# Altium project smart-water-quality-breakout.PrjPcb (part 5 of 5)

## Sheet rtc.SchDoc
size Letter
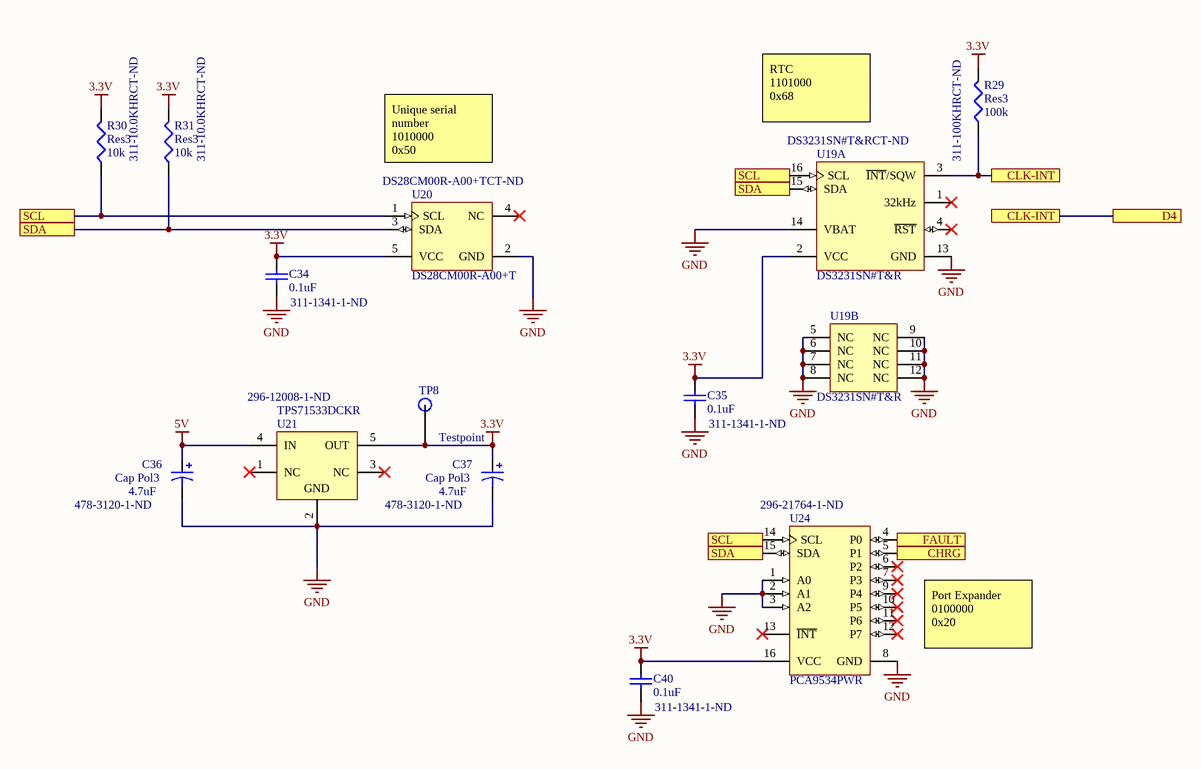
[diagram p5: rtc.SchDoc]

### Parts
C34  value 0.1uF  Supplier Part Number 1: 311-1341-1-ND  [1608[0603]]  (hidden comment: Cap Semi)
C35  value 0.1uF  Supplier Part Number 1: 311-1341-1-ND  [1608[0603]]  (hidden comment: Cap Semi)
C36  Cap Pol3  value 4.7uF  Supplier Part Number 1: 478-3120-1-ND  [1206-pol]
C37  Cap Pol3  value 4.7uF  Supplier Part Number 1: 478-3120-1-ND  [1206-pol]
C40  value 0.1uF  Supplier Part Number 1: 311-1341-1-ND  [1608[0603]]  (hidden comment: Cap Semi)
R29  Res3  value 100k  Supplier Part Number 1: 311-100KHRCT-ND  [J1-0603]
R30  Res3  value 10k  Supplier Part Number 1: 311-10.0KHRCT-ND  [J1-0603]
R31  Res3  value 10k  Supplier Part Number 1: 311-10.0KHRCT-ND  [J1-0603]
TP8  Testpoint  [testpoint]  (no BOM)
U19  DS3231SN#T&R  Supplier Part Number 1: DS3231SN#T&RCT-ND  [W16#H2_M]  (parts A,B of 2)
U20  DS28CM00R-A00+T  Supplier Part Number 1: DS28CM00R-A00+TCT-ND  [U5+1_M]
U21  TPS71533DCKR  Supplier Part Number 1: 296-12008-1-ND  [DCK0005A_L]
U24  PCA9534PWR  Supplier Part Number 1: 296-21764-1-ND  [PW0016A_N]

### Ports
CHRG, CLK-INT, D4, FAULT, SCL, SDA

### Nets
3.3V: C34.1 C35.1 C37.1 C40.1 R29.2 R30.2 R31.2 TP8.1 U19.2(VCC) U20.5(VCC) U21.5(OUT) U24.16(VCC)
5V: C36.1 U21.4(IN)
GND: C34.2 C35.2 C36.2 C37.2 C40.2 U19.5(NC) U19.6(NC) U19.7(NC) U19.8(NC) U19.9(NC) U19.10(NC) U19.11(NC) U19.12(NC) U19.13(GND) U19.14(VBAT) U20.2(GND) U21.2(GND) U24.1(A0) U24.2(A1) U24.3(A2) U24.8(GND)
NetR29_1: R29.1 U19.3(~{INT}/SQW) ; port CLK-INT, port D4
NetR30_1: R30.1 U19.16(SCL) U20.1(SCL) U24.14(SCL) ; port SCL
NetR31_1: R31.1 U19.15(SDA) U20.3(SDA) U24.15(SDA) ; port SDA
NetR32_2: U24.5(P1) ; port CHRG
NetR33_2: U24.4(P0) ; port FAULT

Not connected (* = marked no-connect by the designer): U19 1(32kHz)* 4(~{RST})*; U20 4(NC)*; U21 1(NC)* 3(NC)*; U24 6(P2)* 7(P3)* 9(P4)* 10(P5)* 11(P6)* 12(P7)* 13(~{INT})*

### Notes on the sheet
- Unique serial number
  1010000
  0x50
- RTC
  1101000
  0x68
- Port Expander
  0100000
  0x20

### Library data of the parts
C34 C35 C40 = Cap Semi: Capacitor (Semiconductor SIM Model); Manufacturer: Yageo; Manufacturer Part Number: CC0603KRX7R8BB104; Capacitance: 100nF; Tolerance: 10%; Voltage Rating: 25V; Dielectric: X7R; ComponentLink1URL: http://www.samsungsem.com/servlet/FileDownload?type=spec&file=CL10B104KB8NNNC.pdf; ComponentLink1Description: http://www.samsungsem.com/servlet/FileDownload?type=spec&file=CL10B104KB8NNNC.pdf; Supplier 1: Digi-Key; Stock 1: 22812167; Pricing 1: 1=0.10000, 10=0.05000, 100=0.02220, 500=0.01584, 1000=0.01245 (USD); RoHS: Yes; Mount: Surface Mount; Case/Package: 0603; Number of Pins: 2; Case Code (Imperial): 0603; Case Code (Metric): 1608; Min Operating Temperature: -55°C; Max Operating Temperature: 125°C; Packaging: Tape and Reel; Package Quantity: 1; Voltage Rating (DC): 25V; Termination: SMD/SMT; Composition: Ceramic; Voltage: 25V; Length: 1.6mm; Height: 0.8mm; Width: 0.8mm; Thickness: 0.035inch; Depth: 0.8mm; Radiation Hardening: No; REACH SVHC: Unknown; Lead Free: Lead Free; Halogen Free: Halogen Free; ComponentLink2URL: https://datasheet.ciiva.com/11786/0900766b80c10176-11786120.pdf?src-supplier=RSComponents; ComponentLink2Description: https://datasheet.ciiva.com/11786/0900766b80c10176-11786120.pdf?src-supplier=RSComponents; ComponentLink3URL: https://datasheet.ciiva.com/144/mlccorderingcode-144075.pdf?src-supplier=Digi-Key; ComponentLink3Description: https://datasheet.ciiva.com/144/mlccorderingcode-144075.pdf?src-supplier=Digi-Key; ComponentLink4URL: https://datasheet.ciiva.com/17434/upy-gphc-x7r-6-3v-to-50v-8-17434263.pdf?src-supplier=Avnet+Europe; ComponentLink4Description: https://datasheet.ciiva.com/17434/upy-gphc-x7r-6-3v-to-50v-8-17434263.pdf?src-supplier=Avnet+Europe; ComponentLink5URL: https://datasheet.ciiva.com/26829/getdatasheetpartid-403577-26829431.pdf?src-supplier=Verical; ComponentLink5Description: https://datasheet.ciiva.com/26829/getdatasheetpartid-403577-26829431.pdf?src-supplier=Verical; ComponentLink6URL: https://datasheet.ciiva.com/11587/upy-gphc-x7r-6-3v-to-50v-8-11587208.pdf?src-supplier=Avnet; ComponentLink6Description: https://datasheet.ciiva.com/11587/upy-gphc-x7r-6-3v-to-50v-8-11587208.pdf?src-supplier=Avnet; ComponentLink7URL: https://datasheet.ciiva.com/13389/upy-gphc-x7r-6-3v-to-50v-8-13389352.pdf?src-supplier=Mouser; ComponentLink7Description: https://datasheet.ciiva.com/13389/upy-gphc-x7r-6-3v-to-50v-8-13389352.pdf?src-supplier=Mouser; ComponentLink8URL: https://datasheet.ciiva.com/28450/1489800-28450584.pdf?src-supplier=Element14; ComponentLink8Description: https://datasheet.ciiva.com/28450/1489800-28450584.pdf?src-supplier=Element14; ComponentLink9URL: https://datasheet.ciiva.com/144/mlccorderingcode-144073.pdf?src-supplier=Digi-Key; ComponentLink9Description: https://datasheet.ciiva.com/144/mlccorderingcode-144073.pdf?src-supplier=Digi-Key; ComponentLink10URL: https://datasheet.ciiva.com/144/mlccorderingcode-144074.pdf?src-supplier=Digi-Key; ComponentLink10Description: https://datasheet.ciiva.com/144/mlccorderingcode-144074.pdf?src-supplier=Digi-Key; ComponentLink11URL: https://datasheet.ciiva.com/7978/1489800-7978155.pdf?src-supplier=Element14; ComponentLink11Description: https://datasheet.ciiva.com/7978/1489800-7978155.pdf?src-supplier=Element14
C36 C37 = Cap Pol3: Polarized Capacitor (Surface Mount); Manufacturer: AVX Corporation; Manufacturer Part Number: NOJA475M010RWJ; Manufacturer Size Code: A; Tolerance: ±20%; Dissipation Factor: 6%; Supplier 1: Digi-Key; RoHS: RoHS Compliant; Category: Capacitors; Stock 1: 5356; Pricing 1: 1=0.68, 10=0.485, 100=0.319, 500=0.2363, 1000=0.20086 (CAD); Packaging: Cut Tape (CT); Part Status: Active; Mounting Type: Surface Mount; Package / Case: 1206 (3216 Metric); Height - Seated (Max): 0.071" (1.80mm); Features: -; Operating Temperature: -55°C ~ 105°C; Supplier Device Package: 1206 (3216 Metric); Size / Dimension: 0.126" L x 0.063" W (3.20mm x 1.60mm); ComponentLink1URL: http://datasheets.avx.com/NOJ.pdf; ComponentLink1Description: http://datasheets.avx.com/NOJ.pdf
R29 = Res3: Resistor; Manufacturer: Yageo; Manufacturer Part Number: RC0603FR-07100KL; Tolerance: ±1%; Power (Watts): 0.1W, 1/10W; Temperature Coefficient: ±100ppm/°C; Published: 8-Jun-2000; LatestRevisionDate: 29-May-2009; LatestRevisionNote: IPC-7351 Footprint Added.; PackageReference: J1-0603; Publisher: Altium Limited; PackageDescription: Chip Resistor; Supplier 1: Digi-Key; RoHS: RoHS Compliant; Category: Resistors; Stock 1: 8279421; Pricing 1: 1=0.14, 10=0.021, 100=0.0086, 1000=0.00383, 2500=0.00333 (CAD); Packaging: Cut Tape (CT); Part Status: Active; Composition: Thick Film; Features: Moisture Resistant; Operating Temperature: -55°C ~ 155°C; Package / Case: 0603 (1608 Metric); Supplier Device Package: 0603; Size / Dimension: 0.063" L x 0.032" W (1.60mm x 0.80mm); Height - Seated (Max): 0.022" (0.55mm); Failure Rate: -; ComponentLink1URL: http://www.yageo.com/documents/recent/PYu-RC_Group_51_RoHS_L_7.pdf; ComponentLink1Description: http://www.yageo.com/documents/recent/PYu-RC_Group_51_RoHS_L_7.pdf
R30 R31 = Res3: Resistor; Manufacturer: Yageo; Manufacturer Part Number: RC0603FR-0710KL; Tolerance: 1%; Resistance: 10kR; Temperature Coefficient: 100ppm/°C; Voltage Rating (DC): 50V; Power Rating: 100mW; Voltage Rating: 75V; Published: 8-Jun-2000; LatestRevisionDate: 29-May-2009; LatestRevisionNote: IPC-7351 Footprint Added.; PackageReference: J1-0603; Publisher: Altium Limited; PackageDescription: Chip Resistor; Supplier 1: Digi-Key; Stock 1: 90146690; Pricing 1: 1 = 0.10000, 10 = 0.02400, 100 = 0.00970, 1000 = 0.00437, 2500 = 0.00379 (USD); RoHS: Yes; Case/Package: 0603; Number of Pins: 2; Weight: 7.1E-05oz; Case Code (Imperial): 0603; Case Code (Metric): 1608; Min Operating Temperature: -55°C; Max Operating Temperature: 155°C; Composition: Thick Film; Packaging: Tape and Reel; Military Standard: Not; Termination: SMD/SMT; Length: 1.6mm; Height: 0.45mm; Width: 0.8mm; Depth: 0.8mm; Lead Pitch: 0.3mm; REACH SVHC: No SVHC; Lead Free: Lead Free; ComponentLink1URL: https://datasheet.ciiva.com/7660/38590-7660789.pdf?src-supplier=Element14; ComponentLink1Description: https://datasheet.ciiva.com/7660/38590-7660789.pdf?src-supplier=Element14; ComponentLink2URL: https://datasheet.ciiva.com/15189/getdatasheetpartid-409289-15189591.pdf?src-supplier=Verical; ComponentLink2Description: https://datasheet.ciiva.com/15189/getdatasheetpartid-409289-15189591.pdf?src-supplier=Verical; ComponentLink3URL: https://datasheet.ciiva.com/46440/1868787-46440891.pdf?src-supplier=Element14; ComponentLink3Description: https://datasheet.ciiva.com/46440/1868787-46440891.pdf?src-supplier=Element14; ComponentLink4URL: https://datasheet.ciiva.com/7983/443971-7983596.pdf?src-supplier=Element14; ComponentLink4Description: https://datasheet.ciiva.com/7983/443971-7983596.pdf?src-supplier=Element14; ComponentLink5URL: https://datasheet.ciiva.com/7746/1738695-7746239.pdf?src-supplier=Element14; ComponentLink5Description: https://datasheet.ciiva.com/7746/1738695-7746239.pdf?src-supplier=Element14; ComponentLink6URL: https://datasheet.ciiva.com/22747/443971-22747519.pdf?src-supplier=Element14; ComponentLink6Description: https://datasheet.ciiva.com/22747/443971-22747519.pdf?src-supplier=Element14
TP8 = SMT Testpoint
U19 = CMP-0254-00375-1: Extremely Accurate I2C-Integrated Real-Time Clock/TCXO/Crystal, 16-Pin SO, -40 to 85 degC, RoHS Qualified, Reel; Manufacturer: Maxim; Max Supply Voltage: 5.5V; Min Supply Voltage: 2.3V; Interface: I2C; Logic Function: Clock; Time Format: HH:MM:SS; Date Format: YY-MM-DD-dd; Operating Supply Voltage: 3.3V; DatasheetVersion: Rev 8, Jul-2010; ComponentLink2Description: Datasheet; ComponentLink3Description: Package Specification; Code_JEDEC: MS-013-AA; ComponentLink1URL: http://www.maxim-ic.com; PackageDescription: 16-Pin Small-Outline IC, Wide (0.3in), 1.27 mm Pitch, SOIC (W), RoHS Qualified; ComponentLink3URL: http://pdfserv.maxim-ic.com/package_dwgs/21-0042.PDF; Code_IPC: SOIC127P1030-16; PackageReference: W16#H2; PackageVersion: revD, 2010; ComponentLink1Description: Manufacturer URL; ComponentLink2URL: http://datasheets.maxim-ic.com/en/ds/DS3231.pdf; Supplier 1: Digi-Key; Manufacturer Part Number: DS3231SN#T&R; Stock 1: 3292; Pricing 1: 1=9.05000, 10=8.17200, 25=7.79160, 100=6.76520, 250=6.46120, 500=5.89108 (USD); RoHS: Yes; Mount: Surface Mount; Case/Package: SOIC; Number of Pins: 16; Contact Plating: Tin; Min Operating Temperature: -40°C; Max Operating Temperature: 85°C; Packaging: Tape and Reel; Package Quantity: 1000; Radiation Hardening: No; Lead Free: Lead Free; ComponentLink4URL: https://datasheet.ciiva.com/17307/ds3231-17307128.pdf?src-supplier=Avnet+Europe; ComponentLink4Description: https://datasheet.ciiva.com/17307/ds3231-17307128.pdf?src-supplier=Avnet+Europe; ComponentLink5URL: https://datasheet.ciiva.com/12291/ds3231-102175-12291260.pdf?src-supplier=Mouser; ComponentLink5Description: https://datasheet.ciiva.com/12291/ds3231-102175-12291260.pdf?src-supplier=Mouser; ComponentLink6URL: https://datasheet.ciiva.com/14244/ds3231-14244637.pdf?src-supplier=Avnet; ComponentLink6Description: https://datasheet.ciiva.com/14244/ds3231-14244637.pdf?src-supplier=Avnet; ComponentLink7URL: https://datasheet.ciiva.com/14244/ds3231-14244733.pdf?src-supplier=Avnet; ComponentLink7Description: https://datasheet.ciiva.com/14244/ds3231-14244733.pdf?src-supplier=Avnet
U20 = CMP-0219-00326-1: I²C/SMBus Silicon Serial Number, 5-pin SOT23, -40° to + 85° C, Pb-Free, Tape and Reel; Manufacturer: Maxim; Max Supply Voltage: 5.25V; Min Supply Voltage: 1.62V; DatasheetVersion: Nov-2006; PackageReference: U5+1; Code_JEDEC: MO-178AA; PackageVersion: revF, 2006; PackageDescription: 5-Pin Small-Outline Transistor Package, 0.95 mm Pitch, 2.8 mm Lead Span, SOT-23, Pb-Free; Supplier 1: Digi-Key; Manufacturer Part Number: DS28CM00R-A00+T; RoHS: Yes; Stock 1: 17327; Pricing 1: 1 = 1.67000, 10 = 1.50400, 25 = 1.41880, 100 = 1.20880, 250 = 1.13508, 500 = 0.99318, 1000 = 0.82292 (USD); Mount: Surface Mount; Case/Package: SOT-23-5; Number of Pins: 5; Min Operating Temperature: -40°C; Max Operating Temperature: 85°C; Packaging: Tape and Reel; Package Quantity: 1; Length: 3mm; Height: 1.3mm; Width: 1.75mm; Radiation Hardening: No; REACH SVHC: Unknown; Lead Free: Lead Free; ComponentLink1URL: https://datasheets.maximintegrated.com/en/ds/DS28CM00.pdf; ComponentLink1Description: https://datasheets.maximintegrated.com/en/ds/DS28CM00.pdf; ComponentLink2URL: http://datasheets.maximintegrated.com/en/ds/DS28CM00.pdf; ComponentLink2Description: http://datasheets.maximintegrated.com/en/ds/DS28CM00.pdf; ComponentLink3URL: http://www.mouser.com/ds/2/256/DS28CM00-102134.pdf; ComponentLink3Description: http://www.mouser.com/ds/2/256/DS28CM00-102134.pdf
U21 = CMP-0394-00925-2: Single Output LDO, 50 mA, Fixed 3.3 V Output, 3 to 24 V Input, 5-pin SC70 (DCK), -40 to 85 degC, Green (RoHS & no Sb/Br); Manufacturer: Texas Instruments; Accuracy(%): 4; Vdo(Typ)(mV): 415; Vin(Min)(V): 3; Iq(Typ)(mA): 0.003; Fixed Output Options(V): 3.3; SubFamily: Single Channel LDO; Iout(Max)(A): 0.05; Vin(Max)(V): 24; Dropout Voltage: 415mV; Output Current: 50mA; Number of Outputs: 1; Output Voltage: 3.3V; Max Power Dissipation: 320mW; Max Input Voltage: 24V; Min Input Voltage: 3V; Min Current Limit: 125mA; Input Bias Current: 3.2uA; Polarity: Positive; Quiescent Current: 3uA; Accuracy: 4%; Min Supply Voltage: 2.5V; ComponentLink3Description: Package Specification; ComponentLink1URL: http://www.ti.com/; ComponentLink3URL: http://www.ti.com/litv/pdf/mpds025f; PackageDescription: 5-Pin Plastic Small-Outline, Body 2 x 1.25 mm, Pitch 0.65 mm; PartNumber: TPS71533DCKR; Vout Adj(Min)(V): 3.3; ComponentLink2URL: http://www.ti.com/general/docs/lit/getliterature.tsp?genericPartNumber=TPS71533&fileType=pdf; ComponentLink2Description: Datasheet; ComponentLink1Description: Manufacturer URL; Code_JEDEC: MO-203; Vout Adj(Max)(V): 3.3; Mounting Technology: Surface Mount; DatasheetVersion: SLVS338P; Eco-Plan: Green (RoHS & no Sb/Br); PackageVersion: 4093553-3/G; PackageReference: DCK0005A; Supplier 1: Digi-Key; Manufacturer Part Number: TPS71533DCKR; Stock 1: 159612; Pricing 1: 1 = 0.90000, 10 = 0.80200, 100 = 0.62540, 500 = 0.51664, 1000 = 0.40788 (USD); RoHS: Yes; Case/Package: SC; Number of Pins: 5; Min Operating Temperature: -40°C; Max Operating Temperature: 125°C; Package Quantity: 3000; Packaging: Tape and Reel; Power Rating: 320mW; Max Output Current: 50mA; Number of Regulators: 1; Min Output Voltage: 3.3V; Power Dissipation: 320mW; Output Voltage Accuracy: 4%; Max Output Voltage: 3.3V; Output Type: Fixed; Nominal Output Voltage: 3.3V; Termination: SMD/SMT; Current Rating: 50mA; Length: 2mm; Height: 0.9mm; Width: 1.25mm; Radiation Hardening: No; Lead Free: Lead Free; REACH SVHC: No SVHC; ComponentLink4URL: https://datasheet.ciiva.com/22700/1835023-22700176.pdf?src-supplier=Element14; ComponentLink4Description: https://datasheet.ciiva.com/22700/1835023-22700176.pdf?src-supplier=Element14; ComponentLink5URL: https://datasheet.ciiva.com/27051/1116751-27051464.pdf?src-supplier=Jameco; ComponentLink5Description: https://datasheet.ciiva.com/27051/1116751-27051464.pdf?src-supplier=Jameco; ComponentLink6URL: https://datasheet.ciiva.com/7992/1854688-7992972.pdf?src-supplier=Element14; ComponentLink6Description: https://datasheet.ciiva.com/7992/1854688-7992972.pdf?src-supplier=Element14
U24 = CMP-0314-00331-2: Remote 8-Bit I2C and Low-Power I/O Expander with Interrupt Output and Configuration Register, 2.3 to 5.5 V, -40 to 85 degC, 16-pin TSSOP (PW), Green (RoHS & no Sb/Br); Manufacturer: Texas Instruments; SubFamily: I2C IO Expander; # of I/Os: 8; Configuration Registers: Yes; Max Frequency(kHz): 400; fSCLK(Max)(MHz): 0.1, 0.4; VCC(Min)(V): 2.3; I2C Address: 0100 xxx; VCC(Max)(V): 5.5; Frequency: 400kHz; Operating Supply Voltage: 5.5V; Code_JEDEC: MO-153; Push-Pull I/O Type: Yes; ComponentLink1URL: http://www.ti.com/general/docs/lit/getliterature.tsp?genericPartNumber=PCA9534&fileType=pdf; Interrupt Output: Yes; PartNumber: PCA9534PWR; Eco-Plan: Green (RoHS & no Sb/Br); No. of Outputs: 8; 5V Tolerant I/O: Yes; PackageDescription: 16-Pin Plastic Thin Small Outline Package 5 x 4.4 mm Body ,0.65 mm Pitch; Vcc range(V): 2.3 to 5.5; ComponentLink1Description: Datasheet; PackageReference: PW0016A; Mounting Technology: Surface Mount; PackageVersion: revG, Feb-2011; DatasheetVersion: SCPS124F; Low Power: Yes; Supplier 1: Digi-Key; Manufacturer Part Number: PCA9534PWR; Stock 1: 48653; Pricing 1: 1=1.74000, 10=1.56100, 100=1.25490, 500=1.03104, 1000=0.85428 (USD); RoHS: Yes; Case/Package: TSSOP; Number of Pins: 16; Weight: 0.002183oz; Min Operating Temperature: -40°C; Max Operating Temperature: 85°C; Packaging: Tape and Reel; Package Quantity: 1; Number of Outputs: 8; Number of I/Os: 8; Max Frequency: 400kHz; Radiation Hardening: No; Lead Free: Lead Free; ComponentLink3URL: https://datasheet.ciiva.com/15134/getdatasheetpartid-253001-15134573.pdf?src-supplier=Verical; ComponentLink3Description: https://datasheet.ciiva.com/15134/getdatasheetpartid-253001-15134573.pdf?src-supplier=Verical; ComponentLink4URL: https://datasheet.ciiva.com/1780/pca9534-1780321.pdf?src-supplier=Digi-Key; ComponentLink4Description: https://datasheet.ciiva.com/1780/pca9534-1780321.pdf?src-supplier=Digi-Key; ComponentLink5URL: https://datasheet.ciiva.com/1780/pca9534-1780322.pdf?src-supplier=Digi-Key; ComponentLink5Description: https://datasheet.ciiva.com/1780/pca9534-1780322.pdf?src-supplier=Digi-Key; ComponentLink6URL: https://datasheet.ciiva.com/1780/pca9534-1780323.pdf?src-supplier=Digi-Key; ComponentLink6Description: https://datasheet.ciiva.com/1780/pca9534-1780323.pdf?src-supplier=Digi-Key; ComponentLink7URL: https://datasheet.ciiva.com/3149/pca9534-3149291.pdf?src-supplier=Avnet; ComponentLink7Description: https://datasheet.ciiva.com/3149/pca9534-3149291.pdf?src-supplier=Avnet

## Sheet main-arduino.SchDoc
size Letter
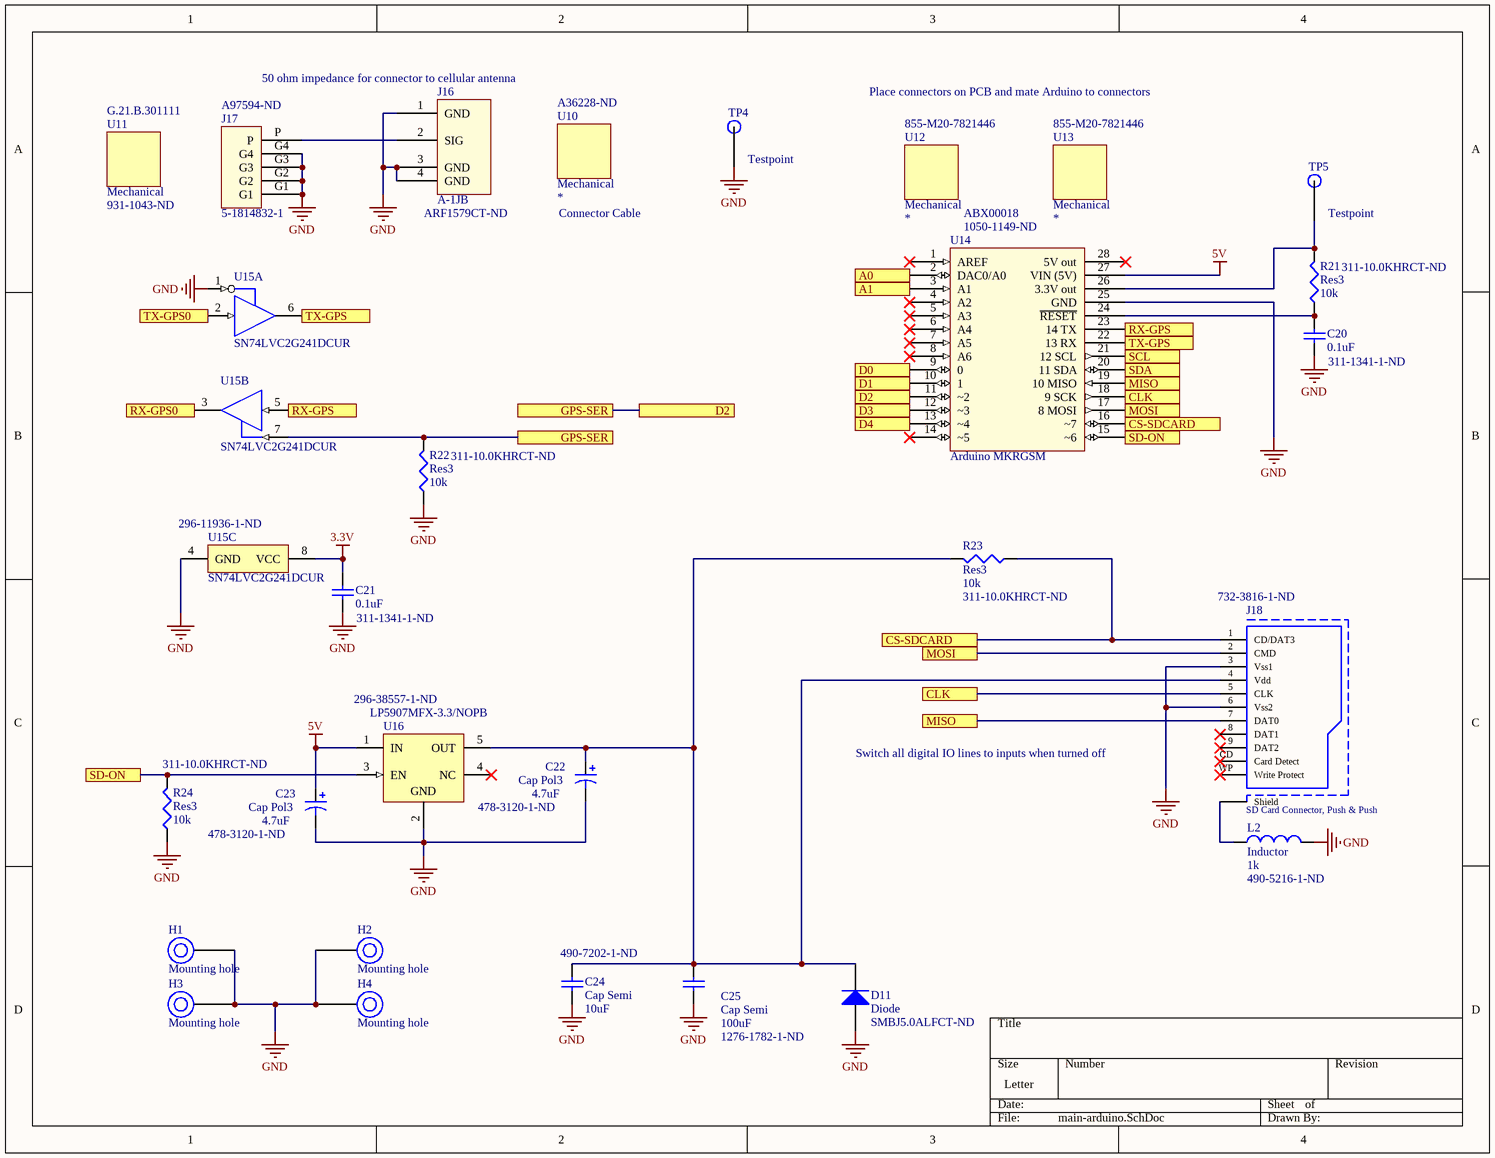
[diagram p6: main-arduino.SchDoc]

### Parts
C20  value 0.1uF  Supplier Part Number 1: 311-1341-1-ND  [1608[0603]]  (hidden comment: Cap Semi)
C21  value 0.1uF  Supplier Part Number 1: 311-1341-1-ND  [1608[0603]]  (hidden comment: Cap Semi)
C22  Cap Pol3  value 4.7uF  Supplier Part Number 1: 478-3120-1-ND  [1206-pol]
C23  Cap Pol3  value 4.7uF  Supplier Part Number 1: 478-3120-1-ND  [1206-pol]
C24  Cap Semi  value 10uF  Supplier Part Number 1: 490-7202-1-ND  [1608[0603]]
C25  Cap Semi  value 100uF  Supplier Part Number 1: 1276-1782-1-ND  [C1206]
D11  Diode  Supplier Part Number 1: SMBJ5.0ALFCT-ND  [smbj]
H1  Mounting hole  [M3 hole]  (no BOM)
H2  Mounting hole  [M3 hole]  (no BOM)
H3  Mounting hole  [M3 hole]  (no BOM)
H4  Mounting hole  [M3 hole]  (no BOM)
J16  A-1JB  Supplier Part Number 1: ARF1579CT-ND  [A-1JB]
J17  5-1814832-1  Supplier Part Number 1: A97594-ND  [5-1814832-1]
J18  SD Card Connector, Push & Push  Supplier Part Number 1: 732-3816-1-ND  [693061010911]
L2  Inductor  value 1k  Supplier Part Number 1: 490-5216-1-ND  [J1-0603]
R21  Res3  value 10k  Supplier Part Number 1: 311-10.0KHRCT-ND  [J1-0603]
R22  Res3  value 10k  Supplier Part Number 1: 311-10.0KHRCT-ND  [J1-0603]
R23  Res3  value 10k  Supplier Part Number 1: 311-10.0KHRCT-ND  [J1-0603]
R24  Res3  value 10k  Supplier Part Number 1: 311-10.0KHRCT-ND  [J1-0603]
TP4  Testpoint  [testpoint]  (no BOM)
TP5  Testpoint  [testpoint]  (no BOM)
U10  Mechanical  Supplier Part Number 2: A36228-ND  (mechanical)
U11  Mechanical  Supplier Part Number 1: 931-1043-ND  Supplier Part Number 2: G.21.B.301111  (mechanical)
U12  Mechanical  Supplier Part Number 2: 855-M20-7821446  (mechanical)
U13  Mechanical  Supplier Part Number 2: 855-M20-7821446  (mechanical)
U14  Arduino MKRGSM  Supplier Part Number 1: 1050-1149-ND  Manufacturer Part Number: ABX00018  [MKRGSM]
U15  SN74LVC2G241DCUR  [DCU0008A_M]  (parts A,B,C of 3)
U16  LP5907MFX-3.3/NOPB  Supplier Part Number 1: 296-38557-1-ND  [DBV0005A_L]

### Ports
A0, A1, CLK, CS-SDCARD, D0, D1, D2, D3, D4, GPS-SER, MISO, MOSI, RX-GPS, RX-GPS0, SCL, SD-ON, SDA, TX-GPS, TX-GPS0

### Nets
3.3V: C21.1 U15.8(VCC)
5V: C23.1 U14.27(VIN_(5V)) U16.1(IN)
GND: C20.2 C21.2 C22.2 C23.2 C24.1 C25.1 D11.1(A) H1.1 H2.1 H3.1 H4.1 J16.1(GND) J16.3(GND) J16.4(GND) J17.G1 J17.G2 J17.G3 J17.G4 J18.3(Vss1) J18.6(Vss2) L2.2 R22.1 R24.1 TP4.1 U14.25(GND) U15.1(1~{OE}) U15.4(GND) U16.2(GND)
NetC20_1: C20.1 R21.1 U14.24(~{RESET})
NetC22_1: C22.1 C24.2 C25.2 D11.2(K) J18.4(Vdd) R23.2 U16.5(OUT)
NetD4_2: U14.3(A1) ; port A1
NetD5_2: U14.9(0) ; port D0
NetJ16_2: J16.2(SIG) J17.P
NetJ18_1: J18.1(CD/DAT3) R23.1 U14.16(~7) ; port CS-SDCARD
NetJ18_2: J18.2(CMD) U14.17(8_MOSI) ; port MOSI
NetJ18_5: J18.5(CLK) U14.18(9_SCK) ; port CLK
NetJ18_7: J18.7(DAT0) U14.19(10_MISO) ; port MISO
NetJ18_Shield: J18.Shield L2.1
NetQ1_1: U14.12(~3) ; port D3
NetR9_1: U14.10(1) ; port D1
NetR17_1: U15.2(1A) ; port TX-GPS0
NetR18_1: U15.3(2Y) ; port RX-GPS0
NetR20_2: R22.2 U14.11(~2) U15.7(2OE) ; port GPS-SER, port D2
NetR21_2: R21.2 TP5.1 U14.26(3.3V_out)
NetR24_2: R24.2 U14.15(~6) U16.3(EN) ; port SD-ON
NetR29_1: U14.13(~4) ; port D4
NetR30_1: U14.21(12_SCL) ; port SCL
NetR31_1: U14.20(11_SDA) ; port SDA
NetU14_2: U14.2(DAC0/A0) ; port A0
NetU14_22: U14.22(13_RX) U15.6(1Y) ; port TX-GPS
NetU14_23: U14.23(14_TX) U15.5(2A) ; port RX-GPS

Not connected (* = marked no-connect by the designer): J18 8(DAT1)* 9(DAT2)* CD(Card_Detect)* WP(Write_Protect)*; U14 1(AREF)* 4(A2)* 5(A3)* 6(A4)* 7(A5)* 8(A6)* 14(~5)* 28(5V_out)*; U16 4(NC)*

### Notes on the sheet
- 50 ohm impedance for connector to cellular antenna
- Place connectors on PCB and mate Arduino to connectors
- Connector Cable
- Switch all digital IO lines to inputs when turned off

### Library data of the parts
C20 C21 = Cap Semi: as C34 on sheet rtc; ComponentLink1URL: http://www.samsungsem.com/servlet/FileDownload?type=spec&file=CL10B104KB8NNNC.pdf; ComponentLink1Description: http://www.samsungsem.com/servlet/FileDownload?type=spec&file=CL10B104KB8NNNC.pdf; Supplier 1: Digi-Key; Stock 1: 22812167; Pricing 1: 1=0.10000, 10=0.05000, 100=0.02220, 500=0.01584, 1000=0.01245 (USD); RoHS: Yes; Mount: Surface Mount; Case/Package: 0603; Number of Pins: 2; Case Code (Imperial): 0603; Case Code (Metric): 1608; Min Operating Temperature: -55°C; Max Operating Temperature: 125°C; Packaging: Tape and Reel; Package Quantity: 1; Voltage Rating (DC): 25V; Termination: SMD/SMT; Composition: Ceramic; Voltage: 25V; Length: 1.6mm; Height: 0.8mm; Width: 0.8mm; Thickness: 0.035inch; Depth: 0.8mm; Radiation Hardening: No; REACH SVHC: Unknown; Lead Free: Lead Free; Halogen Free: Halogen Free; ComponentLink2URL: https://datasheet.ciiva.com/11786/0900766b80c10176-11786120.pdf?src-supplier=RSComponents; ComponentLink2Description: https://datasheet.ciiva.com/11786/0900766b80c10176-11786120.pdf?src-supplier=RSComponents; ComponentLink3URL: https://datasheet.ciiva.com/144/mlccorderingcode-144075.pdf?src-supplier=Digi-Key; ComponentLink3Description: https://datasheet.ciiva.com/144/mlccorderingcode-144075.pdf?src-supplier=Digi-Key; ComponentLink4URL: https://datasheet.ciiva.com/17434/upy-gphc-x7r-6-3v-to-50v-8-17434263.pdf?src-supplier=Avnet+Europe; ComponentLink4Description: https://datasheet.ciiva.com/17434/upy-gphc-x7r-6-3v-to-50v-8-17434263.pdf?src-supplier=Avnet+Europe; ComponentLink5URL: https://datasheet.ciiva.com/26829/getdatasheetpartid-403577-26829431.pdf?src-supplier=Verical; ComponentLink5Description: https://datasheet.ciiva.com/26829/getdatasheetpartid-403577-26829431.pdf?src-supplier=Verical; ComponentLink6URL: https://datasheet.ciiva.com/11587/upy-gphc-x7r-6-3v-to-50v-8-11587208.pdf?src-supplier=Avnet; ComponentLink6Description: https://datasheet.ciiva.com/11587/upy-gphc-x7r-6-3v-to-50v-8-11587208.pdf?src-supplier=Avnet; ComponentLink7URL: https://datasheet.ciiva.com/13389/upy-gphc-x7r-6-3v-to-50v-8-13389352.pdf?src-supplier=Mouser; ComponentLink7Description: https://datasheet.ciiva.com/13389/upy-gphc-x7r-6-3v-to-50v-8-13389352.pdf?src-supplier=Mouser; ComponentLink8URL: https://datasheet.ciiva.com/28450/1489800-28450584.pdf?src-supplier=Element14; ComponentLink8Description: https://datasheet.ciiva.com/28450/1489800-28450584.pdf?src-supplier=Element14; ComponentLink9URL: https://datasheet.ciiva.com/144/mlccorderingcode-144073.pdf?src-supplier=Digi-Key; ComponentLink9Description: https://datasheet.ciiva.com/144/mlccorderingcode-144073.pdf?src-supplier=Digi-Key; ComponentLink10URL: https://datasheet.ciiva.com/144/mlccorderingcode-144074.pdf?src-supplier=Digi-Key; ComponentLink10Description: https://datasheet.ciiva.com/144/mlccorderingcode-144074.pdf?src-supplier=Digi-Key; ComponentLink11URL: https://datasheet.ciiva.com/7978/1489800-7978155.pdf?src-supplier=Element14; ComponentLink11Description: https://datasheet.ciiva.com/7978/1489800-7978155.pdf?src-supplier=Element14
C22 C23 = Cap Pol3: as C36 on sheet rtc; Supplier 1: Digi-Key; RoHS: RoHS Compliant; Category: Capacitors; Stock 1: 5356; Pricing 1: 1=0.68, 10=0.485, 100=0.319, 500=0.2363, 1000=0.20086 (CAD); Packaging: Cut Tape (CT); Part Status: Active; Mounting Type: Surface Mount; Package / Case: 1206 (3216 Metric); Height - Seated (Max): 0.071" (1.80mm); Features: -; Operating Temperature: -55°C ~ 105°C; Supplier Device Package: 1206 (3216 Metric); Size / Dimension: 0.126" L x 0.063" W (3.20mm x 1.60mm); ComponentLink1URL: http://datasheets.avx.com/NOJ.pdf; ComponentLink1Description: http://datasheets.avx.com/NOJ.pdf
C24 = Cap Semi: Capacitor (Semiconductor SIM Model); Manufacturer: Murata; Manufacturer Part Number: GRM188R61E106MA73D; Voltage Rating: 25V; Tolerance: 20%; Dielectric: X5R; ComponentLink1URL: http://www.yuden.co.jp/productdata/catalog/en/mlcc06_e.pdf; ComponentLink1Description: http://www.yuden.co.jp/productdata/catalog/en/mlcc06_e.pdf; ComponentLink2URL: https://datasheet.ciiva.com/25710/cl31a106kahnnne-25710837.pdf?src-supplier=Digi-Key; ComponentLink2Description: https://datasheet.ciiva.com/25710/cl31a106kahnnne-25710837.pdf?src-supplier=Digi-Key; ComponentLink3URL: https://datasheet.ciiva.com/15195/getdatasheetpartid-355210-15195990.pdf?src-supplier=Verical; ComponentLink3Description: https://datasheet.ciiva.com/15195/getdatasheetpartid-355210-15195990.pdf?src-supplier=Verical; ComponentLink4URL: https://datasheet.ciiva.com/29201/452519-da-01-en-vs-kondensator-1206-29201124.pdf?src-supplier=Conrad; ComponentLink4Description: https://datasheet.ciiva.com/29201/452519-da-01-en-vs-kondensator-1206-29201124.pdf?src-supplier=Conrad; Supplier 1: Digi-Key; Stock 1: 278450; Pricing 1: 1=0.42000, 10=0.29300, 100=0.17560, 500=0.13172, 1000=0.11123 (USD); RoHS: Yes; Mount: Surface Mount; Case/Package: 0603; Number of Pins: 2; Weight: 0.000222oz; Case Code (Metric): 1608; Case Code (Imperial): 0603; Min Operating Temperature: -55°C; Max Operating Temperature: 85°C; Capacitance: 10uF; Packaging: Tape and Reel; Package Quantity: 1; Voltage: 25V; Termination: SMD/SMT; Composition: Ceramic; Voltage Rating (DC): 25V; Length: 1.6mm; Height: 0.8mm; Width: 0.031inch; Thickness: 0.031inch; Depth: 0.8mm; REACH SVHC: No SVHC; Lead Free: Lead Free; ComponentLink5URL: https://datasheet.ciiva.com/22619/c02e-22619674.pdf?src-supplier=Element14; ComponentLink5Description: https://datasheet.ciiva.com/22619/c02e-22619674.pdf?src-supplier=Element14; ComponentLink6URL: https://datasheet.ciiva.com/22776/608985-22776426.pdf?src-supplier=Farnell; ComponentLink6Description: https://datasheet.ciiva.com/22776/608985-22776426.pdf?src-supplier=Farnell; ComponentLink7URL: https://datasheet.ciiva.com/22776/c02e-22776427.pdf?src-supplier=Farnell; ComponentLink7Description: https://datasheet.ciiva.com/22776/c02e-22776427.pdf?src-supplier=Farnell; ComponentLink8URL: https://datasheet.ciiva.com/14906/partnumbering-e-01-14906429.pdf?src-supplier=Digi-Key; ComponentLink8Description: https://datasheet.ciiva.com/14906/partnumbering-e-01-14906429.pdf?src-supplier=Digi-Key; ComponentLink9URL: https://datasheet.ciiva.com/14906/partnumbering-e-01-14906431.pdf?src-supplier=Digi-Key; ComponentLink9Description: https://datasheet.ciiva.com/14906/partnumbering-e-01-14906431.pdf?src-supplier=Digi-Key
C25 = Cap Semi: Capacitor (Semiconductor SIM Model); Manufacturer: Samsung; Manufacturer Part Number: CL31A107MQHNNNE; Material: Ceramic; Tolerance: 20%; Voltage Rating: 6.3V; Dielectric: X5R; Published: 8-Jun-2000; LatestRevisionDate: 29-May-2009; LatestRevisionNote: IPC-7351 Footprint Added.; PackageReference: C1206; Publisher: Altium Limited; PackageDescription: Chip Capacitor; Supplier 1: Digi-Key; Stock 1: 76664; Pricing 1: 1=0.64, 10=0.456, 100=0.3001, 500=0.2223, 1000=0.189 (USD); Mount: Surface Mount; Case/Package: 1206; Case Code (Metric): 3216; Case Code (Imperial): 1206; Contact Plating: Tin; Min Operating Temperature: -55°C; Max Operating Temperature: 85°C; Capacitance: 100uF; Packaging: Tape and Reel; Package Quantity: 2000; Voltage: 6.3V; Length: 3.2mm; Height: 1.6mm; Width: 0.063inch; Thickness: 0.071inch; Depth: 1.6mm; Radiation Hardening: No; ComponentLink1URL: https://datasheet.ciiva.com/20173/71-0886-20173093.pdf; ComponentLink1Description: https://datasheet.ciiva.com/20173/71-0886-20173093.pdf; ComponentLink2URL: https://datasheet.ciiva.com/25723/cl31a107mqhnnne-25723159.pdf; ComponentLink2Description: https://datasheet.ciiva.com/25723/cl31a107mqhnnne-25723159.pdf; ComponentLink3URL: https://datasheet.ciiva.com/16437/cl31a107mqhnnne-16437212.pdf; ComponentLink3Description: https://datasheet.ciiva.com/16437/cl31a107mqhnnne-16437212.pdf; ComponentLink4URL: https://datasheet.ciiva.com/15195/getdatasheetpartid-358449-15195997.pdf; ComponentLink4Description: https://datasheet.ciiva.com/15195/getdatasheetpartid-358449-15195997.pdf; ComponentLink5URL: https://datasheet.ciiva.com/29201/452463-da-01-en-vs-kondensator-1206-29201265.pdf; ComponentLink5Description: https://datasheet.ciiva.com/29201/452463-da-01-en-vs-kondensator-1206-29201265.pdf
D11 = Diode: Default Diode; Manufacturer: Littelfuse; Manufacturer Part Number: SMBJ5.0A; Operating Supply Voltage: 5V; Max Surge Current: 65.3A; Min Breakdown Voltage: 6.4V; Clamping Voltage: 9.2V; Peak Pulse Power: 600W; Number of Channels: 1; Polarity: Unidirectional; Max Breakdown Voltage: 7V; Power Line Protection: No; Test Current: 10mA; ESD Protection: Yes; Max Reverse Leakage Current: 800uA; Element Configuration: Single; Current: 68A; ComponentLink1URL: http://www.bourns.com/docs/Product-Datasheets/SMBJ.pdf; ComponentLink1Description: http://www.bourns.com/docs/Product-Datasheets/SMBJ.pdf; ComponentLink2URL: https://datasheet.ciiva.com/17412/ds19002-17412873.pdf; ComponentLink2Description: https://datasheet.ciiva.com/17412/ds19002-17412873.pdf; ComponentLink3URL: https://datasheet.ciiva.com/16427/ds19002-16427518.pdf; ComponentLink3Description: https://datasheet.ciiva.com/16427/ds19002-16427518.pdf; Supplier 1: Digi-Key; Stock 1: 37178; Pricing 1: 1=0.42, 10=0.327, 25=0.2756, 100=0.2244, 250=0.18588, 500=0.15384, 1000=0.11538 (USD); Mount: Surface Mount; Case/Package: SMB; Number of Pins: 2; Min Operating Temperature: -55°C; Max Operating Temperature: 150°C; Packaging: Tape and Reel; Package Quantity: 3000; Reverse Standoff Voltage: 5V; Breakdown Voltage: 6.4V; Peak Pulse Current: 65.3A; Voltage Rating (DC): 5V; Direction: Unidirectional; Reverse Breakdown Voltage: 6.4V; Number of Elements: 1; Number of Unidirectional Channels: 1; Termination: SMD/SMT; Power Dissipation: 600W; Max Power Dissipation: 600W; Leakage Current: 800uA; Voltage: 5V; Length: 4.57mm; Height: 2.44mm; Width: 3.94mm; Radiation Hardening: No; REACH SVHC: Unknown; Lead Free: Lead Free; ComponentLink4URL: https://datasheet.ciiva.com/18403/70184815-18403605.pdf; ComponentLink4Description: https://datasheet.ciiva.com/18403/70184815-18403605.pdf; ComponentLink5URL: https://datasheet.ciiva.com/15143/getdatasheetpartid-117005-15143558.pdf; ComponentLink5Description: https://datasheet.ciiva.com/15143/getdatasheetpartid-117005-15143558.pdf; ComponentLink6URL: https://datasheet.ciiva.com/46381/1677318-46381958.pdf; ComponentLink6Description: https://datasheet.ciiva.com/46381/1677318-46381958.pdf; ComponentLink7URL: https://datasheet.ciiva.com/25624/0900766b810f4eeb-25624712.pdf; ComponentLink7Description: https://datasheet.ciiva.com/25624/0900766b810f4eeb-25624712.pdf; ComponentLink8URL: https://datasheet.ciiva.com/331/littelfuse-tvs-diode-smbj-datasheet-pdf-331131.pdf; ComponentLink8Description: https://datasheet.ciiva.com/331/littelfuse-tvs-diode-smbj-datasheet-pdf-331131.pdf; ComponentLink9URL: https://datasheet.ciiva.com/34302/1546929-34302459.pdf; ComponentLink9Description: https://datasheet.ciiva.com/34302/1546929-34302459.pdf; ComponentLink10URL: https://datasheet.ciiva.com/331/littelfuse-tvs-diode-smbj-datasheet-pdf-331132.pdf; ComponentLink10Description: https://datasheet.ciiva.com/331/littelfuse-tvs-diode-smbj-datasheet-pdf-331132.pdf; ComponentLink11URL: https://datasheet.ciiva.com/4508/littelfuse-tvs-diode-smbj-48653-4508124.pdf; ComponentLink11Description: https://datasheet.ciiva.com/4508/littelfuse-tvs-diode-smbj-48653-4508124.pdf; ComponentLink12URL: https://datasheet.ciiva.com/331/littelfuse-tvs-diode-smbj-datasheet-pdf-331133.pdf; ComponentLink12Description: https://datasheet.ciiva.com/331/littelfuse-tvs-diode-smbj-datasheet-pdf-331133.pdf
H1-H4 = Mouting hole
J16 = A-1JB: Manufacturer: Amphenol RF; Body Material: Bronze,Liquid Crystal Polymer,Polymer; Plating: Liquid Crystal Polymer,Polymer; Body Plating: Silver; Dielectric Material: Polymer; Impedance: 50R; Frequency: 6Hz; Mating Cycles: 30; Insulation Resistance: 500MR; Polarity: Standard; Max Frequency: 6GHz; Connector Type: Coaxial,Male Pin; Supplier 1: Digi-Key; Manufacturer Part Number: A-1JB; RoHS: Yes; Stock 1: 52082; Pricing 1: 1 = 0.89000, 10 = 0.78500, 25 = 0.73920, 50 = 0.70840, 100 = 0.67760, 250 = 0.61600, 500 = 0.55440, 1000 = 0.49280 (USD); Mount: Surface Mount; Weight: 0.001058oz; Contact Material: Brass; Contact Plating: Gold; Insulation Material: Polymer; Min Operating Temperature: -40°C; Max Operating Temperature: 90°C; Packaging: Tape and Reel; Package Quantity: 1; Fastening Type: Snap; Termination: Solder; Orientation: Straight; Length: 2.6mm; Height: 1.244mm; Depth: 3mm; Radiation Hardening: No; REACH SVHC: Unknown; Lead Free: Lead Free; ComponentLink1URL: http://drawings.amphenolrf.com/Customer_Outline/CA-1JB.pdf; ComponentLink1Description: http://drawings.amphenolrf.com/Customer_Outline/CA-1JB.pdf; ComponentLink2URL: http://www.mouser.com/ds/2/18/CA-1JB-713210.pdf; ComponentLink2Description: http://www.mouser.com/ds/2/18/CA-1JB-713210.pdf; ComponentLink3URL: https://www.distrelec.biz/Web/Downloads/46/08/04614608.pdf?mime=application%2Fpdf; ComponentLink3Description: https://www.distrelec.biz/Web/Downloads/46/08/04614608.pdf?mime=application%2Fpdf; ComponentLink4URL: http://www.farnell.com/datasheets/689597.pdf; ComponentLink4Description: http://www.farnell.com/datasheets/689597.pdf; ComponentLink5URL: http://www.alliedelec.com/m/d/41feb3dea93af6045b471b16e58c5e32.pdf; ComponentLink5Description: http://www.alliedelec.com/m/d/41feb3dea93af6045b471b16e58c5e32.pdf; ComponentLink6URL: https://www.verical.com/server-webapp/html/getDatasheet?partID=168895; ComponentLink6Description: https://www.verical.com/server-webapp/html/getDatasheet?partID=168895; ComponentLink7URL: http://www.amphenolrf.com/media/downloads/2852/CA-1PAX113-XXXYZ.pdf; ComponentLink7Description: http://www.amphenolrf.com/media/downloads/2852/CA-1PAX113-XXXYZ.pdf; ComponentLink8URL: http://www.jameco.com/Jameco/Products/ProdDS/2036357.pdf; ComponentLink8Description: http://www.jameco.com/Jameco/Products/ProdDS/2036357.pdf
J17 = 5-1814832-1: Manufacturer: TE Connectivity; Body Material: Zinc; Plating: Nickel; Body Plating: Gold; Dielectric Material: PTFE; Impedance: 50R; Frequency: 3GHz; Gender: Female; Connector Type: SMA; Polarity: Normal; Wire/Cable Type: Coaxial; Insulation Resistance: 5GR; Connector System: Cable-to-Board; Number of Positions: 1; Sealable: No (Without); Tail Length: 4mm; Supplier 1: Digi-Key; Manufacturer Part Number: 5-1814832-1; Stock 1: 34232; Pricing 1: 1 = 1.99000, 10 = 1.80400, 25 = 1.69360, 50 = 1.62000, 100 = 1.54640, 250 = 1.39908, 500 = 1.28864, 1000 = 1.10454 (USD); RoHS: Yes; Mount: Through Hole; Case/Package: SMA; Contact Material: Bronze; Contact Plating: Gold; Insulation Material: Polytetrafluoroethylene; Min Operating Temperature: -67°C; Max Operating Temperature: 185°C; Package Quantity: 1; Fastening Type: Threaded; Packaging: Box; Termination: Through Hole; Max Frequency: 3GHz; Orientation: Straight; Length: 0.532inch; Depth: 6.4mm; Radiation Hardening: No; REACH SVHC: No SVHC; Lead Free: Lead Free; ELV: Compliant; ComponentLink1URL: https://datasheet.ciiva.com/642/eng-cd-1814832-b1-642785.pdf?src-supplier=Digi-Key; ComponentLink1Description: https://datasheet.ciiva.com/642/eng-cd-1814832-b1-642785.pdf?src-supplier=Digi-Key; ComponentLink2URL: https://datasheet.ciiva.com/642/eng-cd-1814832-b1-642785.pdf?src-supplier=Avnet; ComponentLink2Description: https://datasheet.ciiva.com/642/eng-cd-1814832-b1-642785.pdf?src-supplier=Avnet; ComponentLink3URL: https://datasheet.ciiva.com/23783/1663582-23783560.pdf?src-supplier=Newark; ComponentLink3Description: https://datasheet.ciiva.com/23783/1663582-23783560.pdf?src-supplier=Newark; ComponentLink4URL: https://datasheet.ciiva.com/16318/5-1814832-1-16318587.pdf?src-supplier=Future+Electronics; ComponentLink4Description: https://datasheet.ciiva.com/16318/5-1814832-1-16318587.pdf?src-supplier=Future+Electronics; ComponentLink5URL: https://datasheet.ciiva.com/11762/0900766b80a70d0f-11762254.pdf?src-supplier=RSComponents; ComponentLink5Description: https://datasheet.ciiva.com/11762/0900766b80a70d0f-11762254.pdf?src-supplier=RSComponents; ComponentLink6URL: https://datasheet.ciiva.com/26824/getdatasheetpartid-396696-26824822.pdf?src-supplier=Verical; ComponentLink6Description: https://datasheet.ciiva.com/26824/getdatasheetpartid-396696-26824822.pdf?src-supplier=Verical; ComponentLink7URL: https://datasheet.ciiva.com/30201/eng-cd-1814832-a-30201302.pdf?src-supplier=Onlinecomponents.com; ComponentLink7Description: https://datasheet.ciiva.com/30201/eng-cd-1814832-a-30201302.pdf?src-supplier=Onlinecomponents.com; ComponentLink8URL: https://datasheet.ciiva.com/25908/eng-cd-1814832-a-25908583.pdf?src-supplier=Avnet+Europe; ComponentLink8Description: https://datasheet.ciiva.com/25908/eng-cd-1814832-a-25908583.pdf?src-supplier=Avnet+Europe; ComponentLink9URL: https://datasheet.ciiva.com/16469/eng-cd-1814832-a-16469256.pdf?src-supplier=Avnet+Asia; ComponentLink9Description: https://datasheet.ciiva.com/16469/eng-cd-1814832-a-16469256.pdf?src-supplier=Avnet+Asia
J18 = 693061010911: WR-CRD SD Card Connector, Push & Push, with Card Detection; Manufacturer: Wurth Electronics; Rated Current: 0.5A; Working Voltage: 500V AC; Connector Type: Connector,Socket; Number of Contacts: 9; ComponentLink1Description: Manufacturer; ComponentLink1URL: http://www.we-online.de; ComponentLink2Description: Datasheet; ComponentLink2URL: http://katalog.we-online.de/em/datasheet/693061010911.pdf; Part Number: 693061010911; Published Date: Feb. 2018; Publisher: Wurth Elektronik; Operating Temperature: -25 to 85 degC; Mounting Technology: SMT; Supplier 1: Digi-Key; Manufacturer Part Number: 693061010911; Stock 1: 1087; Pricing 1: 1=5.01, 10=4.9, 50=4.312, 100=4.116, 200=3.528 (USD); Mount: Surface Mount; Contact Material: Copper,Gold,Copper Alloy; Contact Plating: Gold; Min Operating Temperature: -25°C; Max Operating Temperature: 85°C; Package Quantity: 1; Packaging: Cut Tape; Termination: SMD/SMT; Length: 28.8mm; Height: 2.85mm; Width: 28.9mm; REACH SVHC: Unknown; Lead Free: Lead Free; ComponentLink3URL: https://datasheet.ciiva.com/6935/693061010911-6935172.pdf; ComponentLink3Description: https://datasheet.ciiva.com/6935/693061010911-6935172.pdf; ComponentLink4URL: https://datasheet.ciiva.com/25605/0900766b81113f30-25605368.pdf; ComponentLink4Description: https://datasheet.ciiva.com/25605/0900766b81113f30-25605368.pdf; ComponentLink5URL: https://datasheet.ciiva.com/6935/693061010911-6935165.pdf; ComponentLink5Description: https://datasheet.ciiva.com/6935/693061010911-6935165.pdf
L2 = Inductor: Manufacturer: Murata Electronics North America; Manufacturer Part Number: BLM18HE152SN1D; Code_IEC: 1005; Filter Type: Signal Line; Number of Lines: 1; Impedance @ Frequency: 1.5 kOhm @ 100MHz; Current Rating (Max): 500mA; DC Resistance (DCR) (Max): 500 mOhm; Published: 8-Jun-2000; LatestRevisionDate: 29-May-2009; LatestRevisionNote: IPC-7351 Footprint Added.; PackageReference: 0402-A; Publisher: Altium Limited; PackageDescription: Chip Inductor; Code_JEITA: 0402; Supplier 1: Digi-Key; RoHS: RoHS Compliant; Category: Filters; Stock 1: 303514; Pricing 1: 1=0.28, 10=0.215, 25=0.1776, 50=0.1532, 100=0.1378, 250=0.1164, 500=0.10416, 1000=0.08884 (CAD); Packaging: Cut Tape (CT); Part Status: Active; Ratings: -; Operating Temperature: -55°C ~ 125°C; Package / Case: 0603 (1608 Metric); Mounting Type: Surface Mount; Height (Max): 0.037" (0.95mm); Size / Dimension: 0.063" L x 0.032" W (1.60mm x 0.80mm); ComponentLink1URL: http://www.murata.com/en-us/products/productdata/8796741599262/ENFA0004.pdf; ComponentLink1Description: http://www.murata.com/en-us/products/productdata/8796741599262/ENFA0004.pdf
R21-R24 = Res3: as R30 on sheet rtc; Published: 8-Jun-2000; LatestRevisionDate: 29-May-2009; LatestRevisionNote: IPC-7351 Footprint Added.; PackageReference: J1-0603; Publisher: Altium Limited; PackageDescription: Chip Resistor; Supplier 1: Digi-Key; Stock 1: 90146690; Pricing 1: 1 = 0.10000, 10 = 0.02400, 100 = 0.00970, 1000 = 0.00437, 2500 = 0.00379 (USD); RoHS: Yes; Case/Package: 0603; Number of Pins: 2; Weight: 7.1E-05oz; Case Code (Imperial): 0603; Case Code (Metric): 1608; Min Operating Temperature: -55°C; Max Operating Temperature: 155°C; Composition: Thick Film; Packaging: Tape and Reel; Military Standard: Not; Termination: SMD/SMT; Length: 1.6mm; Height: 0.45mm; Width: 0.8mm; Depth: 0.8mm; Lead Pitch: 0.3mm; REACH SVHC: No SVHC; Lead Free: Lead Free; ComponentLink1URL: https://datasheet.ciiva.com/7660/38590-7660789.pdf?src-supplier=Element14; ComponentLink1Description: https://datasheet.ciiva.com/7660/38590-7660789.pdf?src-supplier=Element14; ComponentLink2URL: https://datasheet.ciiva.com/15189/getdatasheetpartid-409289-15189591.pdf?src-supplier=Verical; ComponentLink2Description: https://datasheet.ciiva.com/15189/getdatasheetpartid-409289-15189591.pdf?src-supplier=Verical; ComponentLink3URL: https://datasheet.ciiva.com/46440/1868787-46440891.pdf?src-supplier=Element14; ComponentLink3Description: https://datasheet.ciiva.com/46440/1868787-46440891.pdf?src-supplier=Element14; ComponentLink4URL: https://datasheet.ciiva.com/7983/443971-7983596.pdf?src-supplier=Element14; ComponentLink4Description: https://datasheet.ciiva.com/7983/443971-7983596.pdf?src-supplier=Element14; ComponentLink5URL: https://datasheet.ciiva.com/7746/1738695-7746239.pdf?src-supplier=Element14; ComponentLink5Description: https://datasheet.ciiva.com/7746/1738695-7746239.pdf?src-supplier=Element14; ComponentLink6URL: https://datasheet.ciiva.com/22747/443971-22747519.pdf?src-supplier=Element14; ComponentLink6Description: https://datasheet.ciiva.com/22747/443971-22747519.pdf?src-supplier=Element14
TP4 TP5 = SMT Testpoint
U10 = Mechanical part: Manufacturer: TE Connectivity; Manufacturer Part Number: 2015357-3; Gender: Female to Female; Wire/Cable Type: Coaxial; Impedance: 50R; Connector Type A: Plug; Max Frequency: 6GHz; Max Voltage Rating (AC): 60V; Cable Length: 0.1m; Wire/Cable Diameter: 0.054inch; Supplier Part Number 1: *; Supplier 2: Digi-Key; Stock 2: 61484; Pricing 2: 1 = 2.48000, 10 = 2.24700, 25 = 2.10920, 50 = 2.01760, 100 = 1.92590, 250 = 1.74248, 500 = 1.60492, 1000 = 1.37565, 2500 = 1.28394 (USD); RoHS: Yes; Mount: Cable; Contact Plating: Gold; Color: Grey; Min Operating Temperature: -40°C; Max Operating Temperature: 90°C; Packaging: Bulk; Package Quantity: 50; Connector Type B: Plug; Frequency: 6GHz; Features: Shielded; Length: 3.94inch; Radiation Hardening: No; ELV: Compliant; ComponentLink1URL: https://datasheet.ciiva.com/30140/eng-ds-1-1773441-5-1207-30140424.pdf?src-supplier=Onlinecomponents.com; ComponentLink1Description: https://datasheet.ciiva.com/30140/eng-ds-1-1773441-5-1207-30140424.pdf?src-supplier=Onlinecomponents.com; ComponentLink2URL: https://datasheet.ciiva.com/23/eng-ds-1-1773441-5-1207-23912.pdf?src-supplier=Digi-Key; ComponentLink2Description: https://datasheet.ciiva.com/23/eng-ds-1-1773441-5-1207-23912.pdf?src-supplier=Digi-Key
U11 = Mechanical part: Manufacturer: Taoglas; Frequency: 900MHz; Impedance: 50R; Number of Bands: 5; Max Frequency: 2.17GHz; Supplier 2: Avnet; Manufacturer Part Number: G.21.B.301111; Stock 2: 0; RoHS: Yes; Mount: Screw; Package Quantity: 10; Packaging: Bulk; Termination: SMA; Height: 1.14inch; Lead Free: Lead Free; ComponentLink1URL: https://datasheet.ciiva.com/2792/g2120hercules20genii20penta-band20cellular20antenna20110310-2792514.pdf?src-supplier=Digi-Key; ComponentLink1Description: https://datasheet.ciiva.com/2792/g2120hercules20genii20penta-band20cellular20antenna20110310-2792514.pdf?src-supplier=Digi-Key
U12 U13 = Mechanical part: Manufacturer: Harwin; Manufacturer Part Number: M20-7821446; Max Current Rating: 3A; Contact Resistance: 20mR; Connector Type: Receptacle; Number of Positions: 14; Gender: Female; Pitch: 2.54mm; Supplier Part Number 1: *; Supplier 2: Mouser; Stock 2: 2861; Pricing 2: 1 = 1.44000, 10 = 1.17000, 50 = 1.17000, 100 = 1.12000, 1000 = 0.79500, 10000 = 0.67900 (USD); RoHS: Yes; Mount: Through Hole; Case/Package: SIL; Color: Black; Contact Plating: Tin; Contact Material: Bronze; Housing Color: Black; Housing Material: Polyamide; Min Operating Temperature: -40°C; Max Operating Temperature: 105°C; Package Quantity: 16; Packaging: Rail/Tube; Number of Rows: 1; Contact Gender: Female; Termination: Solder; Orientation: Straight; Length: 35.96mm; Depth: 2.5mm; ComponentLink1URL: https://datasheet.ciiva.com/26948/getdatasheetpartid-384155-26948941.pdf?src-supplier=Verical; ComponentLink1Description: https://datasheet.ciiva.com/26948/getdatasheetpartid-384155-26948941.pdf?src-supplier=Verical
U14 = Arduino MKRGSM: Arduino MKRGSM v2.2 board (800 mil spacing); Supplier 1: Digi-Key; Manufacturer: Arduino; Stock 1: 375; Pricing 1: 1 = 71.13000 (USD); ComponentLink1URL: http://datasheet.octopart.com/ABX00018-Arduino-datasheet-102038264.pdf?src-supplier=Newark; ComponentLink1Description: http://datasheet.octopart.com/ABX00018-Arduino-datasheet-102038264.pdf?src-supplier=Newark
U15 = CMP-0859-00580-3: Dual Buffer/Driver With 3-State Outputs, DCU0008A, LARGE T&R; Manufacturer: Texas Instruments; Schmitt Trigger: No; Logic: True; ICC @ Nom Voltage(Max)(mA): 0.01; Input Type: CMOS/TTL; Technology Family: LVC; Voltage(Nom)(V): 1.8,2.5,3.3,5; VCC(Max)(V): 5.5; Output Drive (IOL/IOH)(Max)(mA): 32/-32; Bits(#): 2; tpd @ Nom Voltage(Max)(ns): 8.8,4.8,4.3,3.7; Sub-Family: Non-Inverting Buffer/Driver; F @ Nom Voltage(Max)(Mhz): 150; VCC(Min)(V): 1.65; Output Type: CMOS; Rating: Catalog; 3-State Output: Yes; Generic Part Number: SN74LVC2G241; PackageReference: DCU0008A; Operating Temperature Range(C): -40 to 125; DatasheetVersion: SCES210N
U16 = CMP-2000-07464-1: Ultra-Low-Noise, Low-IQ LDO, 0.25 A, Fixed 3.3 V Output, 2.2 to 5.5 V Input, -40 to 125 degC, 5-Pin SOT-23 (DBV), Green (RoHS & no Sb/Br), Tape and Reel; Manufacturer: Texas Instruments; Max Output Current: 250mA; Max Input Voltage: 5.5V; Dropout Voltage: 250mV; Number of Regulators: 1; Nominal Output Voltage: 3.3V; Output Voltage Accuracy: 2%; Polarity: Positive; Min Input Voltage: 2.2V; Package Version: 4073253-4/N, 12/2014; Quiescent Current: 425uA; Power Supply Rejection Ratio (PSRR): 82dB; Case\/Package: SOT-23; Lead Free: LeadFree; Package Reference: DBV5; Output Current: 250mA; Package Description: 5-Pin Small Outline Transistor, Body 2.9 x 1.6 mm, Pitch 0.95 mm; Max Operating Temperature: 125degC; Mounting Technology: SurfaceMount; Number of Pins: 5; Mount: SurfaceMount; Manufacturer URL: http://www.ti.com/; Accuracy: 2%; Package URL: http://www.ti.com/lit/ml/mpds018l/mpds018l.pdf; Output Voltage: 3.3V; Radiation Hardening: No; Number of Outputs: 1; Packaging: TapeandReel; RoHSCompliant: true; Min Operating Temperature: -40degC; Datasheet URL: http://www.ti.com/lit/ds/symlink/lp5907.pdf; Package Quantity: 3000; Datasheet Version: Rev. L, 09/2016; REACH SVHC: NoSVHC; Contact Plating: Tin; Supplier 1: Digi-Key; Manufacturer Part Number: LP5907MFX-3.3/NOPB; Stock 1: 414376; Pricing 1: 1 = 0.55000, 10 = 0.47500, 100 = 0.35470, 500 = 0.27872, 1000 = 0.21537 (USD); RoHS: Yes; Case/Package: SOT-23; Output Type: Fixed; ComponentLink1URL: https://datasheet.ciiva.com/15083/lp5907-15083592.pdf?src-supplier=Digi-Key; ComponentLink1Description: https://datasheet.ciiva.com/15083/lp5907-15083592.pdf?src-supplier=Digi-Key; ComponentLink2URL: https://datasheet.ciiva.com/48475/lp5907-48475084.pdf?src-supplier=Avnet; ComponentLink2Description: https://datasheet.ciiva.com/48475/lp5907-48475084.pdf?src-supplier=Avnet

## Nets that join several sheets
3.3V: battery-balancer (R9.2), charger (R32.1 R33.1), rtc (12 pins), main-arduino (C21.1 U15.8)
5V: main-power (9 pins), gps (C17.1 C19.1 U8.1 U9.4), rtc (C36.1 U21.4), main-arduino (C23.1 U14.27 U16.1)
5V-EXT: breakout-1 (8 pins), main-power (C33.2 TP7.1 U18.3)
GND: breakout-1 (13 pins), battery-balancer (19 pins), charger (13 pins), main-power (13 pins), gps (30 pins), rtc (21 pins), main-arduino (28 pins)
VBAT: battery-balancer (C9.1 U1.5 U4.5), charger (6 pins)
VCC: charger (6 pins), main-power (L3.1)
NetD4_2: breakout-1 (D4.2 J5.1 TP10.1), main-arduino (U14.3)
NetD5_2: breakout-1 (D5.2 J6.1 R34.1 TP11.1), main-arduino (U14.9)
NetQ1_1: gps (Q1.1 R19.2), main-arduino (U14.12)
NetR9_1: battery-balancer (R9.1 U4.8), main-arduino (U14.10)
NetR17_1: gps (R17.1), main-arduino (U15.2)
NetR18_1: gps (R18.1), main-arduino (U15.3)
NetR20_2: main-power (R28.2 U18.2), gps (R20.2 U8.3), main-arduino (R22.2 U14.11 U15.7)
NetR29_1: rtc (R29.1 U19.3), main-arduino (U14.13)
NetR30_1: rtc (R30.1 U19.16 U20.1 U24.14), main-arduino (U14.21)
NetR31_1: rtc (R31.1 U19.15 U20.3 U24.15), main-arduino (U14.20)
NetR32_2: charger (R32.2 TP12.1 U5.4), rtc (U24.5)
NetR33_2: charger (R33.2 TP13.1 U5.5), rtc (U24.4)
NetU14_2: breakout-1 (U23.6 U23.7), main-arduino (U14.2)